# Altium schematic sheet helical.SchDoc: Helical Filter
size Letter; CheckedBy: J. Brinton; CompanyName: Signal Laboratories, Inc.; DrawnBy: J. Brinton; Engineer: J. Brinton; Address1: 3479 Edison Way; Address2: Menlo Park CA 94025; Address3: +1 (877) 778-8435; Address4: siglabs.com; Revision: 3; SheetNumber: 20; SheetTotal: 53; ModifiedDate: 4/20/2018
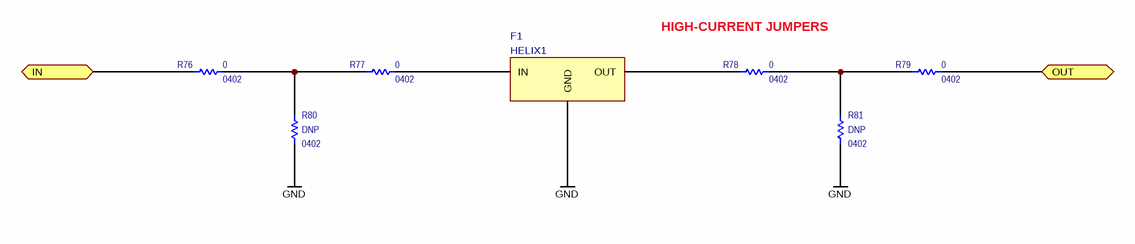
[diagram p0: helical.SchDoc]

## Parts
F1  HELIX1  [HELIX1]
R76  value 0  Package: 0402  [RESC1005X40N]  (hidden comment: HCJ0402ZT0R00)
R77  value 0  Package: 0402  [RESC1005X40N]  (hidden comment: HCJ0402ZT0R00)
R78  value 0  Package: 0402  [RESC1005X40N]  (hidden comment: HCJ0402ZT0R00)
R79  value 0  Package: 0402  [RESC1005X40N]  (hidden comment: HCJ0402ZT0R00)
R80  Package: 0402  Do Not Place: DNP  [RESC1005X40N]  (hidden comment: HCJ0402ZT0R00)
R81  Package: 0402  Do Not Place: DNP  [RESC1005X40N]  (hidden comment: HCJ0402ZT0R00)

## Ports
IN, OUT

## Nets
GND: F1.GND R80.2 R81.2
IN: R76.2 ; port IN
OUT: R79.1 ; port OUT
NetF1_IN: F1.IN R77.1
NetF1_OUT: F1.OUT R78.2
NetR76_1: R76.1 R77.2 R80.1
NetR78_1: R78.1 R79.2 R81.1

## Notes on the sheet
- HIGH-CURRENT JUMPERS
- Title
- Engineer
- Revision
- Drawn By
- Checked By
- Date
- Sheet
- of

## Library data of the parts
F1 = HELIX1: Helical Filter 915MHz; Manufacturer: Signal Laboratories; Manufacturer P/N: HELIX1
R76-R79 = RES 0603: High Current Jumper Chip Resistor 0402; Manufacturer: Stackpole Electronics; Tr: -55:155; Manufacturer P/N: HCJ0402ZT0R00; Do Not Place: *; Tolerance: *
R80 R81 = RES 0603: High Current Jumper Chip Resistor 0402; Manufacturer: Stackpole Electronics; Value: 0; Tr: -55:155; Manufacturer P/N: HCJ0402ZT0R00; Tolerance: *